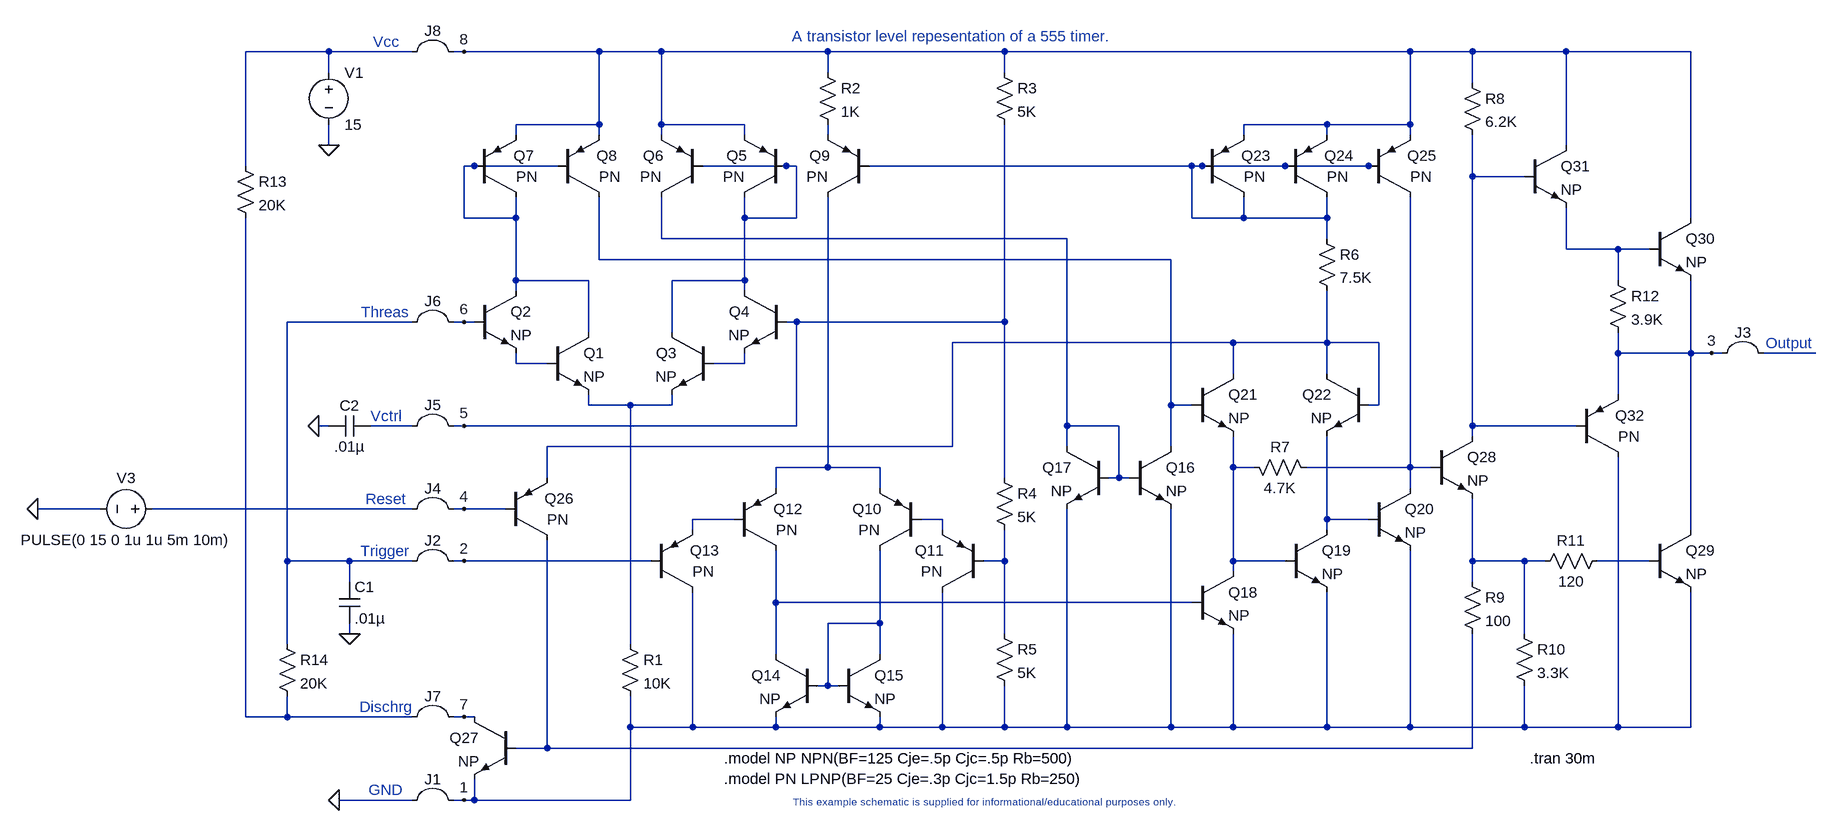
[diagram p0: schematic NE555.asc]
NE555.asc, the LTspice schematic file:
Version 4
SHEET 1 3012 1852
WIRE 544 272 416 272
WIRE 672 272 544 272
WIRE 752 272 736 272
WIRE 960 272 752 272
WIRE 1056 272 960 272
WIRE 1312 272 1056 272
WIRE 1584 272 1312 272
WIRE 2208 272 1584 272
WIRE 2304 272 2208 272
WIRE 2448 272 2304 272
WIRE 2640 272 2448 272
WIRE 544 304 544 272
WIRE 1312 304 1312 272
WIRE 1584 304 1584 272
WIRE 2304 320 2304 272
WIRE 960 384 960 272
WIRE 960 384 832 384
WIRE 1056 384 1056 272
WIRE 1184 384 1056 384
WIRE 2080 384 1952 384
WIRE 2208 384 2208 272
WIRE 2208 384 2080 384
WIRE 832 400 832 384
WIRE 960 400 960 384
WIRE 1056 400 1056 384
WIRE 1184 400 1184 384
WIRE 1312 400 1312 384
WIRE 1952 400 1952 384
WIRE 2080 400 2080 384
WIRE 2208 400 2208 384
WIRE 544 416 544 384
WIRE 2448 416 2448 272
WIRE 416 448 416 272
WIRE 768 448 752 448
WIRE 896 448 768 448
WIRE 1248 448 1120 448
WIRE 1264 448 1248 448
WIRE 1872 448 1376 448
WIRE 1888 448 1872 448
WIRE 2016 448 1888 448
WIRE 2144 448 2016 448
WIRE 2160 448 2144 448
WIRE 2304 464 2304 400
WIRE 2384 464 2304 464
WIRE 752 528 752 448
WIRE 832 528 832 496
WIRE 832 528 752 528
WIRE 1184 528 1184 496
WIRE 1264 528 1264 448
WIRE 1264 528 1184 528
WIRE 1872 528 1872 448
WIRE 1952 528 1952 496
WIRE 1952 528 1872 528
WIRE 2080 528 2080 496
WIRE 2080 528 1952 528
WIRE 2640 528 2640 272
WIRE 1056 560 1056 496
WIRE 1680 560 1056 560
WIRE 2080 560 2080 528
WIRE 2448 576 2448 512
WIRE 2528 576 2448 576
WIRE 2576 576 2528 576
WIRE 960 592 960 496
WIRE 1840 592 960 592
WIRE 832 624 832 528
WIRE 944 624 832 624
WIRE 1184 624 1184 528
WIRE 1184 624 1072 624
WIRE 2528 624 2528 576
WIRE 832 640 832 624
WIRE 1184 640 1184 624
WIRE 672 688 480 688
WIRE 752 688 736 688
WIRE 768 688 752 688
WIRE 1264 688 1248 688
WIRE 1584 688 1584 384
WIRE 1584 688 1264 688
WIRE 944 704 944 624
WIRE 1072 704 1072 624
WIRE 1936 720 1504 720
WIRE 2080 720 2080 640
WIRE 2080 720 1936 720
WIRE 2160 720 2080 720
WIRE 2528 736 2528 704
WIRE 2640 736 2640 624
WIRE 2640 736 2528 736
WIRE 2672 736 2640 736
WIRE 2688 736 2672 736
WIRE 2832 736 2752 736
WIRE 832 752 832 736
WIRE 880 752 832 752
WIRE 1184 752 1184 736
WIRE 1184 752 1136 752
WIRE 1936 768 1936 720
WIRE 2080 768 2080 720
WIRE 2528 800 2528 736
WIRE 944 816 944 800
WIRE 1008 816 944 816
WIRE 1072 816 1072 800
WIRE 1072 816 1008 816
WIRE 1840 816 1840 592
WIRE 1872 816 1840 816
WIRE 2160 816 2160 720
WIRE 2160 816 2144 816
WIRE 544 848 528 848
WIRE 672 848 608 848
WIRE 752 848 736 848
WIRE 1264 848 1264 688
WIRE 1264 848 752 848
WIRE 1680 848 1680 560
WIRE 1760 848 1680 848
WIRE 2304 848 2304 464
WIRE 2464 848 2304 848
WIRE 2304 864 2304 848
WIRE 1504 880 1504 720
WIRE 1504 880 880 880
WIRE 1680 880 1680 848
WIRE 1840 880 1840 816
WIRE 1312 912 1312 496
WIRE 1312 912 1232 912
WIRE 1392 912 1312 912
WIRE 1936 912 1936 864
WIRE 1968 912 1936 912
WIRE 2208 912 2208 496
WIRE 2208 912 2048 912
WIRE 2240 912 2208 912
WIRE 880 928 880 880
WIRE 1584 928 1584 688
WIRE 1760 928 1760 848
WIRE 1760 928 1744 928
WIRE 1776 928 1760 928
WIRE 1232 944 1232 912
WIRE 1392 944 1392 912
WIRE 2208 944 2208 912
WIRE 192 976 96 976
WIRE 672 976 272 976
WIRE 752 976 736 976
WIRE 816 976 752 976
WIRE 1168 992 1104 992
WIRE 1488 992 1456 992
WIRE 2080 992 2080 864
WIRE 2144 992 2080 992
WIRE 1104 1008 1104 992
WIRE 1488 1008 1488 992
WIRE 2080 1008 2080 992
WIRE 2640 1008 2640 736
WIRE 480 1056 480 688
WIRE 576 1056 480 1056
WIRE 672 1056 576 1056
WIRE 752 1056 736 1056
WIRE 1040 1056 752 1056
WIRE 1584 1056 1584 1008
WIRE 1584 1056 1552 1056
WIRE 1936 1056 1936 912
WIRE 2016 1056 1936 1056
WIRE 2304 1056 2304 960
WIRE 2384 1056 2304 1056
WIRE 2416 1056 2384 1056
WIRE 2576 1056 2496 1056
WIRE 1936 1072 1936 1056
WIRE 576 1088 576 1056
WIRE 2304 1088 2304 1056
WIRE 1232 1120 1232 1040
WIRE 1872 1120 1232 1120
WIRE 1392 1152 1392 1040
WIRE 1392 1152 1312 1152
WIRE 576 1168 576 1152
WIRE 1584 1168 1584 1056
WIRE 2384 1168 2384 1056
WIRE 480 1184 480 1056
WIRE 1008 1184 1008 816
WIRE 1232 1200 1232 1120
WIRE 1392 1200 1392 1152
WIRE 1312 1248 1312 1152
WIRE 1312 1248 1296 1248
WIRE 1328 1248 1312 1248
WIRE 416 1296 416 528
WIRE 480 1296 480 1264
WIRE 480 1296 416 1296
WIRE 672 1296 480 1296
WIRE 752 1296 736 1296
WIRE 768 1296 752 1296
WIRE 1008 1312 1008 1264
WIRE 1104 1312 1104 1104
WIRE 1104 1312 1008 1312
WIRE 1232 1312 1232 1296
WIRE 1232 1312 1104 1312
WIRE 1392 1312 1392 1296
WIRE 1392 1312 1232 1312
WIRE 1488 1312 1488 1104
WIRE 1488 1312 1392 1312
WIRE 1584 1312 1584 1248
WIRE 1584 1312 1488 1312
WIRE 1680 1312 1680 976
WIRE 1680 1312 1584 1312
WIRE 1840 1312 1840 976
WIRE 1840 1312 1680 1312
WIRE 1936 1312 1936 1168
WIRE 1936 1312 1840 1312
WIRE 2080 1312 2080 1104
WIRE 2080 1312 1936 1312
WIRE 2208 1312 2208 1040
WIRE 2208 1312 2080 1312
WIRE 2384 1312 2384 1248
WIRE 2384 1312 2208 1312
WIRE 2528 1312 2528 896
WIRE 2528 1312 2384 1312
WIRE 2640 1312 2640 1104
WIRE 2640 1312 2528 1312
WIRE 880 1344 880 1024
WIRE 880 1344 832 1344
WIRE 2304 1344 2304 1168
WIRE 2304 1344 880 1344
WIRE 672 1424 560 1424
WIRE 752 1424 736 1424
WIRE 768 1424 768 1392
WIRE 768 1424 752 1424
WIRE 1008 1424 1008 1312
WIRE 1008 1424 768 1424
FLAG 560 1424 0
FLAG 752 1296 7
FLAG 752 976 4
FLAG 752 1056 2
FLAG 752 1424 1
FLAG 752 848 5
FLAG 752 688 6
FLAG 752 272 8
FLAG 2672 736 3
FLAG 576 1168 0
FLAG 528 848 0
FLAG 544 416 0
FLAG 96 976 0
SYMBOL NPN 880 704 R0
SYMATTR InstName Q1
SYMATTR Value NP
SYMBOL npn 768 640 R0
SYMATTR InstName Q2
SYMATTR Value NP
SYMBOL npn 1136 704 M0
SYMATTR InstName Q3
SYMATTR Value NP
SYMBOL npn 1248 640 M0
SYMATTR InstName Q4
SYMATTR Value NP
SYMBOL res 992 1168 R0
SYMATTR InstName R1
SYMATTR Value 10K
SYMBOL PNP 1248 496 R180
WINDOW 0 60 64 Left 2
WINDOW 3 64 32 Left 2
SYMATTR InstName Q5
SYMATTR Value PN
SYMBOL pnp 1120 496 R180
WINDOW 0 60 64 Left 2
WINDOW 3 64 32 Left 2
SYMATTR InstName Q6
SYMATTR Value PN
SYMBOL pnp 768 496 M180
WINDOW 0 60 64 Left 2
WINDOW 3 64 32 Left 2
SYMATTR InstName Q7
SYMATTR Value PN
SYMBOL pnp 896 496 M180
WINDOW 0 60 64 Left 2
WINDOW 3 64 32 Left 2
SYMATTR InstName Q8
SYMATTR Value PN
SYMBOL pnp 1376 496 R180
WINDOW 0 60 64 Left 2
WINDOW 3 64 32 Left 2
SYMATTR InstName Q9
SYMATTR Value PN
SYMBOL res 1296 288 R0
SYMATTR InstName R2
SYMATTR Value 1K
SYMBOL pnp 1456 1040 R180
WINDOW 0 60 64 Left 2
WINDOW 3 64 32 Left 2
SYMATTR InstName Q10
SYMATTR Value PN
SYMBOL pnp 1552 1104 R180
WINDOW 0 60 64 Left 2
WINDOW 3 64 32 Left 2
SYMATTR InstName Q11
SYMATTR Value PN
SYMBOL pnp 1168 1040 M180
WINDOW 0 60 64 Left 2
WINDOW 3 64 32 Left 2
SYMATTR InstName Q12
SYMATTR Value PN
SYMBOL pnp 1040 1104 M180
WINDOW 0 60 64 Left 2
WINDOW 3 64 32 Left 2
SYMATTR InstName Q13
SYMATTR Value PN
SYMBOL npn 1296 1200 M0
SYMATTR InstName Q14
SYMATTR Value NP
SYMBOL npn 1328 1200 R0
SYMATTR InstName Q15
SYMATTR Value NP
SYMBOL res 1568 288 R0
SYMATTR InstName R3
SYMATTR Value 5K
SYMBOL res 1568 912 R0
SYMATTR InstName R4
SYMATTR Value 5K
SYMBOL res 1568 1152 R0
SYMATTR InstName R5
SYMATTR Value 5K
SYMBOL npn 1776 880 R0
SYMATTR InstName Q16
SYMATTR Value NP
SYMBOL npn 1744 880 M0
SYMATTR InstName Q17
SYMATTR Value NP
SYMBOL npn 1872 1072 R0
SYMATTR InstName Q18
SYMATTR Value NP
SYMBOL npn 2016 1008 R0
SYMATTR InstName Q19
SYMATTR Value NP
SYMBOL npn 2144 944 R0
SYMATTR InstName Q20
SYMATTR Value NP
SYMBOL npn 1872 768 R0
SYMATTR InstName Q21
SYMATTR Value NP
SYMBOL npn 2144 768 M0
SYMATTR InstName Q22
SYMATTR Value NP
SYMBOL pnp 1888 496 M180
WINDOW 0 60 64 Left 2
WINDOW 3 64 32 Left 2
SYMATTR InstName Q23
SYMATTR Value PN
SYMBOL pnp 2016 496 M180
WINDOW 0 60 64 Left 2
WINDOW 3 64 32 Left 2
SYMATTR InstName Q24
SYMATTR Value PN
SYMBOL pnp 2144 496 M180
WINDOW 0 60 64 Left 2
WINDOW 3 64 32 Left 2
SYMATTR InstName Q25
SYMATTR Value PN
SYMBOL res 2064 544 R0
SYMATTR InstName R6
SYMATTR Value 7.5K
SYMBOL res 2064 928 M270
WINDOW 0 32 56 VTop 2
WINDOW 3 0 56 VBottom 2
SYMATTR InstName R7
SYMATTR Value 4.7K
SYMBOL pnp 816 1024 M180
WINDOW 0 60 64 Left 2
WINDOW 3 64 32 Left 2
SYMATTR InstName Q26
SYMATTR Value PN
SYMBOL npn 832 1296 M0
SYMATTR InstName Q27
SYMATTR Value NP
SYMBOL npn 2240 864 R0
SYMATTR InstName Q28
SYMATTR Value NP
SYMBOL res 2288 304 R0
SYMATTR InstName R8
SYMATTR Value 6.2K
SYMBOL res 2288 1072 R0
SYMATTR InstName R9
SYMATTR Value 100
SYMBOL res 2368 1152 R0
SYMATTR InstName R10
SYMATTR Value 3.3K
SYMBOL res 2512 1040 R90
WINDOW 0 0 56 VBottom 2
WINDOW 3 32 56 VTop 2
SYMATTR InstName R11
SYMATTR Value 120
SYMBOL npn 2576 1008 R0
SYMATTR InstName Q29
SYMATTR Value NP
SYMBOL npn 2576 528 R0
SYMATTR InstName Q30
SYMATTR Value NP
SYMBOL npn 2384 416 R0
SYMATTR InstName Q31
SYMATTR Value NP
SYMBOL res 2512 608 R0
SYMATTR InstName R12
SYMATTR Value 3.9K
SYMBOL pnp 2464 896 M180
WINDOW 0 60 64 Left 2
WINDOW 3 64 32 Left 2
SYMATTR InstName Q32
SYMATTR Value PN
SYMBOL MISC\\JUMPER 704 208 R0
SYMATTR InstName J8
SYMBOL misc\\jumper 704 624 R0
SYMATTR InstName J6
SYMBOL misc\\jumper 704 784 R0
SYMATTR InstName J5
SYMBOL misc\\jumper 704 1360 R0
SYMATTR InstName J1
SYMBOL misc\\jumper 704 992 R0
SYMATTR InstName J2
SYMBOL misc\\jumper 704 912 R0
SYMATTR InstName J4
SYMBOL misc\\jumper 704 1232 R0
SYMATTR InstName J7
SYMBOL misc\\jumper 2720 672 R0
SYMATTR InstName J3
SYMBOL cap 608 832 R90
WINDOW 0 0 32 VBottom 2
WINDOW 3 32 32 VTop 2
SYMATTR InstName C2
SYMATTR Value .01µ
SYMBOL cap 560 1088 R0
SYMATTR InstName C1
SYMATTR Value .01µ
SYMBOL res 400 432 R0
SYMATTR InstName R13
SYMATTR Value 20K
SYMBOL res 464 1168 R0
SYMATTR InstName R14
SYMATTR Value 20K
SYMBOL voltage 288 976 R90
WINDOW 0 -32 56 VBottom 2
WINDOW 3 32 56 VTop 2
SYMATTR InstName V3
SYMATTR Value PULSE(0 15 0 1u 1u 5m 10m)
SYMBOL voltage 544 288 R0
SYMATTR InstName V1
SYMATTR Value 15
TEXT 632 1056 Bottom 2 ;Trigger
TEXT 632 1424 Bottom 2 ;GND
TEXT 632 848 Bottom 2 ;Vctrl
TEXT 632 688 Bottom 2 ;Threas
TEXT 632 976 Bottom 2 ;Reset
TEXT 632 1296 Bottom 2 ;Dischrg
TEXT 2792 736 Bottom 2 ;Output
TEXT 1152 1360 Left 2 !.model NP NPN(BF=125 Cje=.5p Cjc=.5p Rb=500)\n.model PN LPNP(BF=25 Cje=.3p Cjc=1.5p Rb=250)
TEXT 2392 1360 Left 2 !.tran 30m
TEXT 1544 1416 Top 1 ;This example schematic is supplied for informational/educational purposes only.
TEXT 1504 264 Bottom 2 ;A transistor level repesentation of a 555 timer.
TEXT 632 272 Bottom 2 ;Vcc

The netlist it stands for:
* NE555.asc
Q1 N002 N010 N012 0 NP
Q2 N002 6 N010 0 NP
Q3 N003 N011 N012 0 NP
Q4 N003 5 N011 0 NP
R1 N012 0 10K
Q5 N003 N003 8 0 PN
Q6 N006 N003 8 0 PN
Q7 N002 N002 8 0 PN
Q8 N008 N002 8 0 PN
Q9 N013 N004 N001 0 PN
R2 8 N001 1K
Q10 N023 N017 N013 0 PN
Q11 0 N019 N017 0 PN
Q12 N022 N016 N013 0 PN
Q13 0 6 N016 0 PN
Q14 N022 N023 0 0 NP
Q15 N023 N023 0 0 NP
R3 8 5 5K
R4 5 N019 5K
R5 N019 0 5K
Q16 N008 N006 0 0 NP
Q17 N006 N006 0 0 NP
Q18 N014 N022 0 0 NP
Q19 N018 N014 0 0 NP
Q20 N015 N018 0 0 NP
Q21 N009 N008 N014 0 NP
Q22 N009 N009 N018 0 NP
Q23 N004 N004 8 0 PN
Q24 N004 N004 8 0 PN
Q25 N015 N004 8 0 PN
R6 N004 N009 7.5K
R7 N015 N014 4.7K
Q26 N024 4 N009 0 PN
Q27 7 N024 0 0 NP
Q28 N005 N015 N020 0 NP
R8 8 N005 6.2K
R9 N020 N024 100
R10 N020 0 3.3K
R11 N021 N020 120
Q29 3 N021 0 0 NP
Q30 8 N007 3 0 NP
Q31 8 N005 N007 0 NP
R12 N007 3 3.9K
Q32 0 N005 3 0 PN
C2 5 0 .01µ
C1 6 0 .01µ
R13 8 7 20K
R14 6 7 20K
V3 4 0 PULSE(0 15 0 1u 1u 5m 10m)
V1 8 0 15
.model NPN NPN
.model PNP PNP
.lib standard.bjt
* Trigger
* GND
* Vctrl
* Threas
* Reset
* Dischrg
* Output
.model NP NPN(BF=125 Cje=.5p Cjc=.5p Rb=500)
.model PN LPNP(BF=25 Cje=.3p Cjc=1.5p Rb=250)
.tran 30m
* This example schematic is supplied for informational/educational purposes only.
* A transistor level repesentation of a 555 timer.
* Vcc
.backanno
.end